# EAGLE schematic H-Bridge Motor Control v02 (EAGLE 7.3.0)
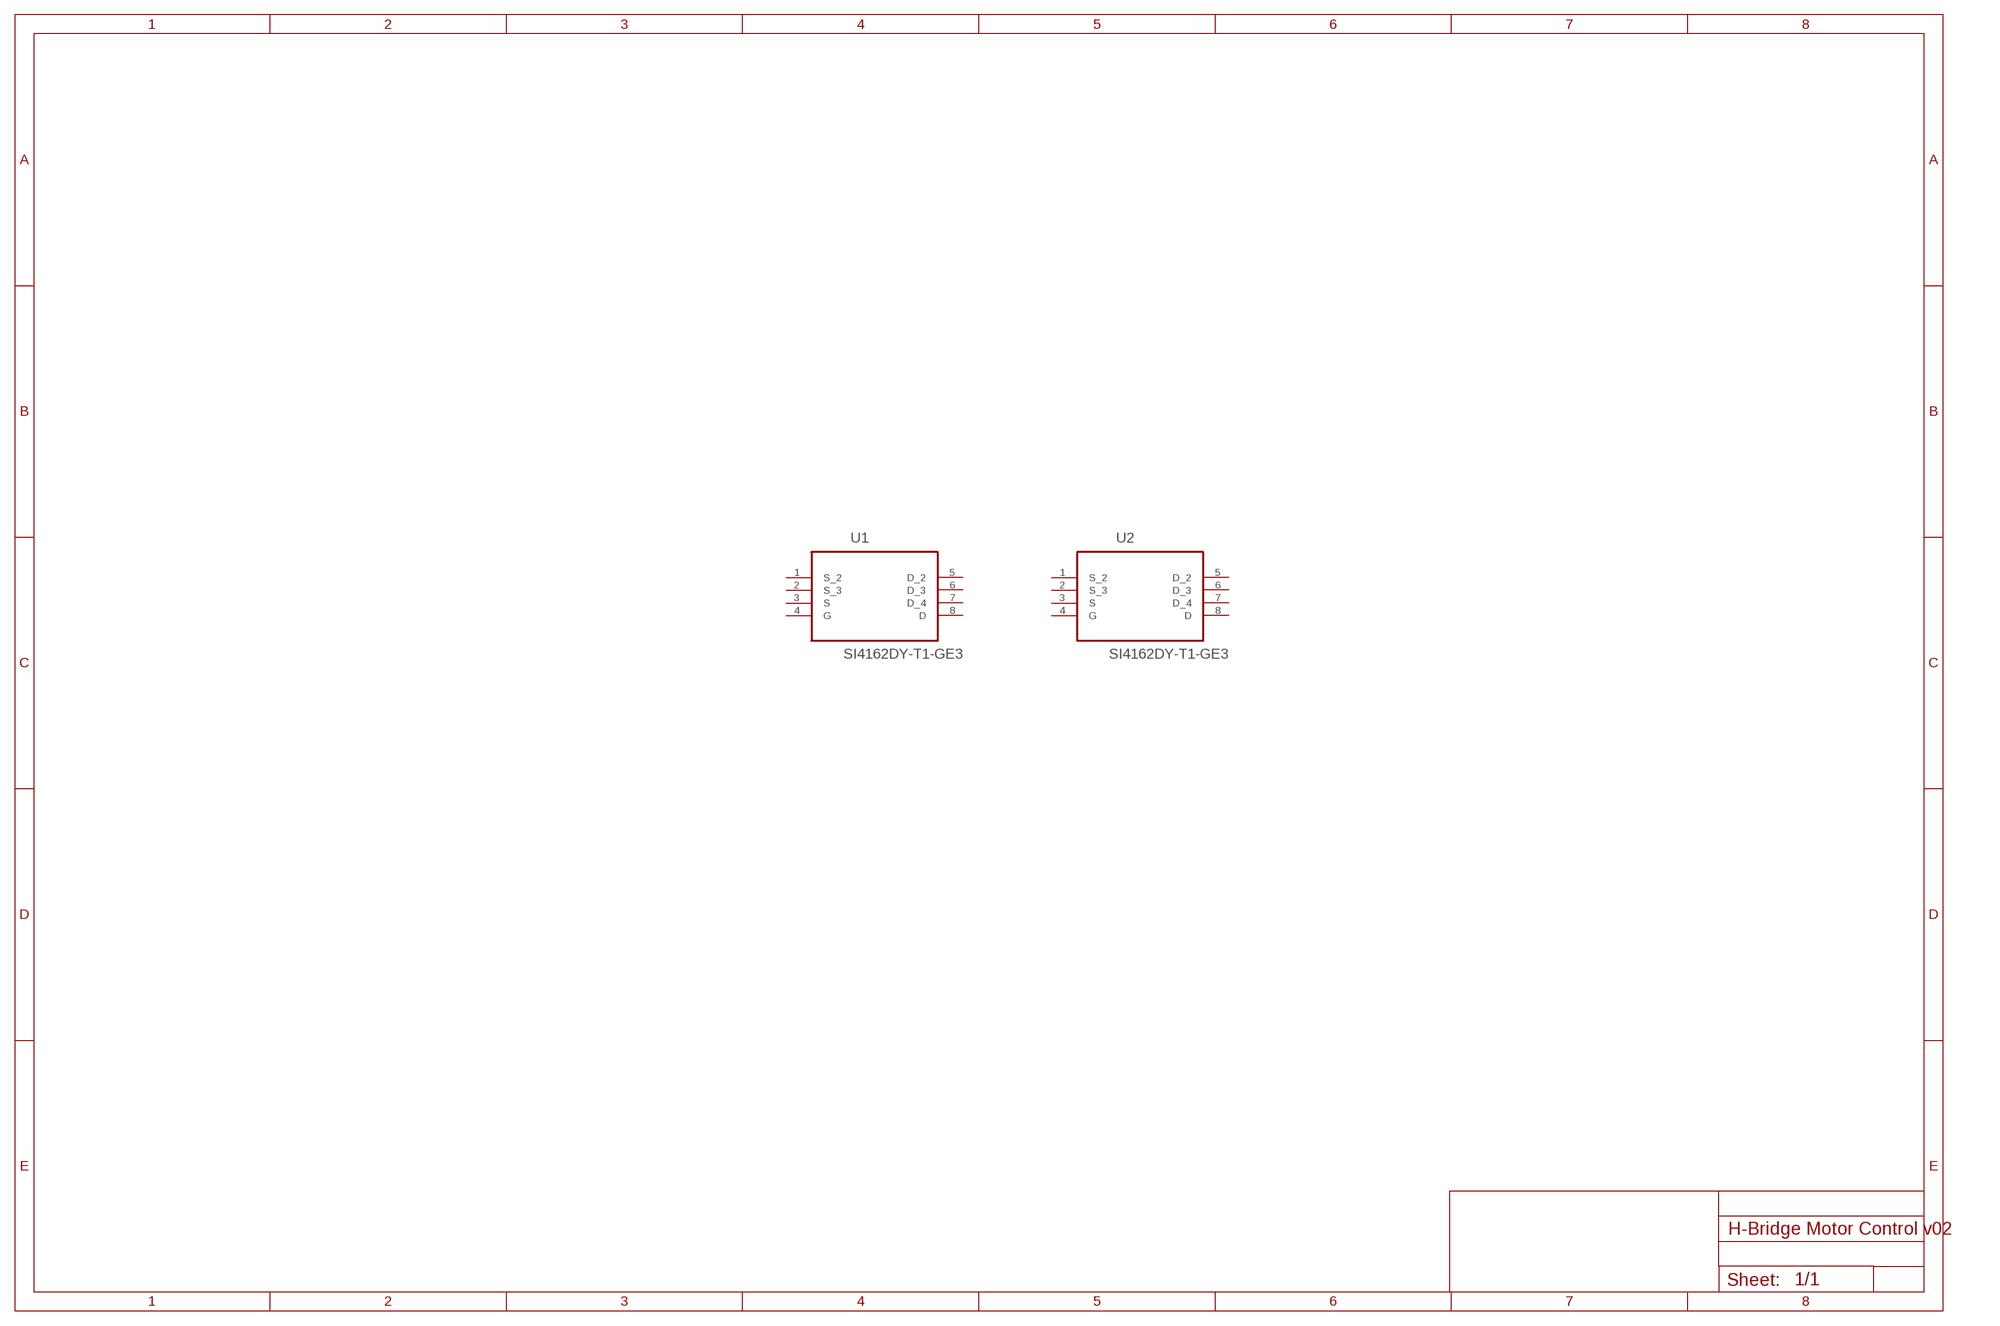
[diagram p0: schematic, sheet 1]

## Parts
U1  SI4162DY-T1-GE3  [SOIC127P600X175-8N]
U2  SI4162DY-T1-GE3  [SOIC127P600X175-8N]
Unconnected: U1.1(S_2) U1.2(S_3) U1.3(S) U1.4(G) U1.5(D_2) U1.6(D_3) U1.7(D_4) U1.8(D) U2.1(S_2) U2.2(S_3) U2.3(S) U2.4(G) U2.5(D_2) U2.6(D_3) U2.7(D_4) U2.8(D)

## Library data of the parts
U1 U2 = Vishay-SI4162DY-T1-GE3:SI4162DY-T1-GE3: N-Channel 30-V (D-S) MOSFET; MPN: SI4162DY-T1-GE3; OC_FARNELL: 1779240; OC_NEWARK: 55R1921; PACKAGE: SOIC-8; SUPPLIER: Vishay Siliconix